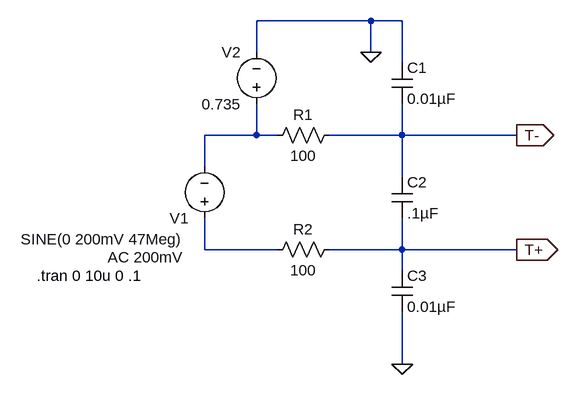
[diagram p0: schematic MAX31856 Interface.asc]
MAX31856 Interface.asc, the LTspice schematic file:
Version 4
SHEET 1 880 680
WIRE 128 -48 -48 -48
WIRE 176 -48 128 -48
WIRE -48 0 -48 -48
WIRE 128 0 128 -48
WIRE 176 16 176 -48
WIRE -48 128 -48 80
WIRE -48 128 -128 128
WIRE -16 128 -48 128
WIRE 176 128 176 80
WIRE 176 128 64 128
WIRE 352 128 176 128
WIRE -128 176 -128 128
WIRE 176 192 176 128
WIRE -128 304 -128 256
WIRE -16 304 -128 304
WIRE 176 304 176 256
WIRE 176 304 64 304
WIRE 352 304 176 304
WIRE 176 336 176 304
WIRE 176 480 176 400
FLAG 128 0 0
FLAG 176 480 0
FLAG 352 128 T-
IOPIN 352 128 Out
FLAG 352 304 T+
IOPIN 352 304 Out
SYMBOL cap 160 16 R0
SYMATTR InstName C1
SYMATTR Value 0.01µF
SYMBOL cap 160 336 R0
SYMATTR InstName C3
SYMATTR Value 0.01µF
SYMBOL res 80 112 R90
WINDOW 0 0 56 VBottom 2
WINDOW 3 32 56 VTop 2
SYMATTR InstName R1
SYMATTR Value 100
SYMBOL res 80 288 R90
WINDOW 0 0 56 VBottom 2
WINDOW 3 32 56 VTop 2
SYMATTR InstName R2
SYMATTR Value 100
SYMBOL voltage -128 272 R180
WINDOW 3 33 -16 Left 2
WINDOW 123 33 -44 Left 2
WINDOW 39 0 0 Left 0
SYMATTR InstName V1
SYMATTR Value SINE(0 200mV 47Meg)
SYMATTR Value2 AC 200mV
SYMBOL voltage -48 96 R180
WINDOW 0 24 96 Left 2
WINDOW 3 24 16 Left 2
WINDOW 123 0 0 Left 0
WINDOW 39 0 0 Left 0
SYMATTR InstName V2
SYMATTR Value 0.735
SYMBOL cap 160 192 R0
SYMATTR InstName C2
SYMATTR Value .1µF
TEXT -386 344 Left 2 !.tran 0 10u 0 .1

The netlist it stands for:
* MAX31856 Interface.asc
C1 0 T- 0.01µF
C3 T+ 0 0.01µF
R1 T- N001 100
R2 T+ N002 100
V1 N002 N001 SINE(0 200mV 47Meg) AC 200mV
V2 N001 0 0.735
C2 T- T+ .1µF
.tran 0 10u 0 .1
.backanno
.end